# EAGLE schematic SensorBoard_copy (EAGLE 7.4.0)
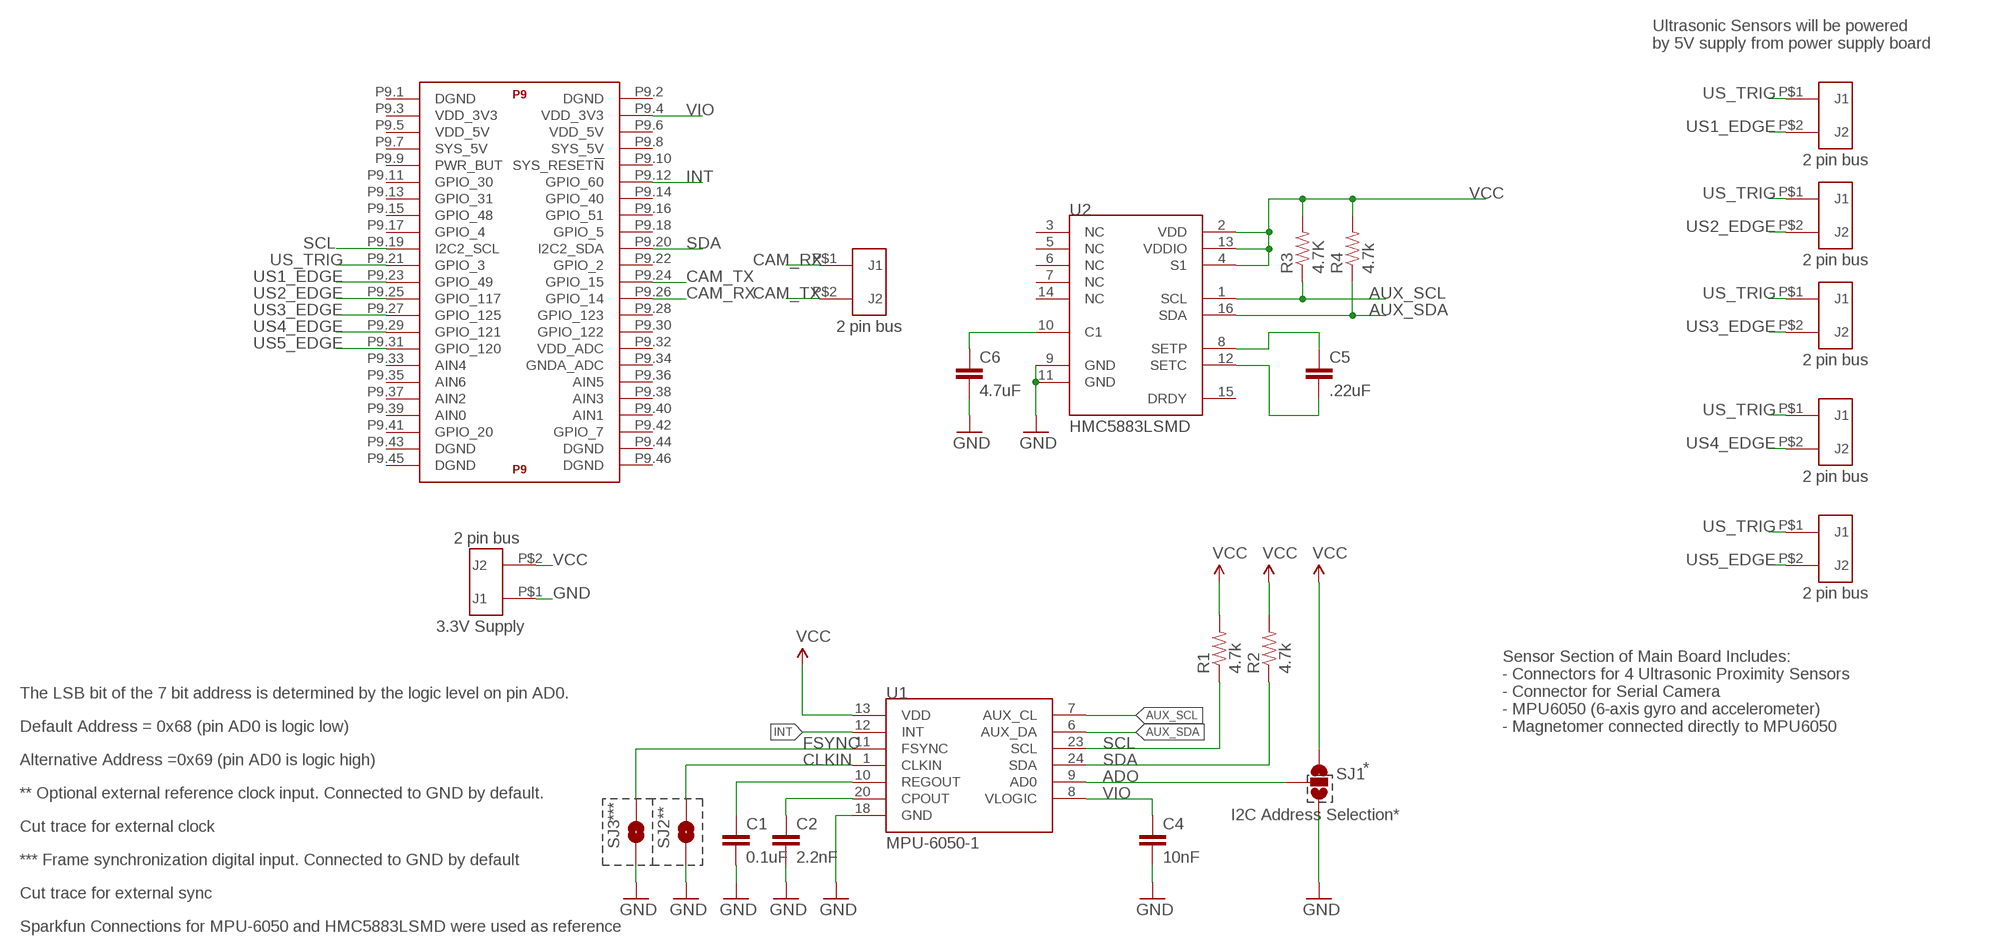
[diagram p0: schematic, sheet 1]

## Parts
C1  0.1uF  CAP0603-CAP  [0603-CAP]
C2  2.2nF  CAP0603-CAP  [0603-CAP]
C4  10nF  CAP0603-CAP  [0603-CAP]
C5  .22uF  CAP0402-CAP  [0402-CAP]
C6  4.7uF  CAP0402-CAP  [0402-CAP]
R1  4.7k  RESISTOR0603-RES  [0603-RES]
R2  4.7k  RESISTOR0603-RES  [0603-RES]
R3  4.7K  RESISTOR0402-RES  [0402-RES]
R4  4.7k  RESISTOR0402-RES  [0402-RES]
SJ1  SOLDERJUMPER_2WAYPASTE2&3  [SJ_3_PASTE2&3]
SJ2  SOLDERJUMPERTRACE  [SJ_2S-TRACE]
SJ3  SOLDERJUMPERTRACE  [SJ_2S-TRACE]
U1  MPU-6050-1  [QFN-24-4MM2]
U2  HMC5883LSMD  [16LPCC]
U$1  2PINBUS2HOLE  [2PINBUS]
U$2  BEAGLE_BONE_BLACK_CAPE  [BEAGLE_BONE_BLACK_CAPE]
U$3  2PINBUS2HOLE  [2PINBUS]
U$4  2PINBUS2HOLE  [2PINBUS]
U$6  2PINBUS2HOLE  [2PINBUS]
U$7  2PINBUS2HOLE  [2PINBUS]
U$8  2PINBUS2HOLE  [2PINBUS]
U$9  2PINBUS2HOLE  [2PINBUS]

## Nets
ADO: SJ1.2 U1.9(AD0)
AUX_SCL: R3.1 U1.7(AUX_CL) U2.1(SCL)
AUX_SDA: R4.1 U1.6(AUX_DA) U2.16(SDA)
CAM_RX: U$2.P9.26(P9:GPIO_14) U$3.P$1(J1)
CAM_TX: U$2.P9.24(P9:GPIO_15) U$3.P$2(J2)
CLKIN: SJ2.2 U1.1(CLKIN)
FSYNC: SJ3.2 U1.11(FSYNC)
GND: C1.2 C2.2 C4.2 C6.2 SJ1.3 SJ2.1 SJ3.1 U1.18(GND) U2.9(GND) U2.11(GND) U$9.P$1(J1)
INT: U1.12(INT) U$2.P9.12(P9:GPIO_60)
N$1: C5.2 U2.12(SETC)
N$2: C6.1 U2.10(C1)
N$3: C2.1 U1.20(CPOUT)
N$4: C5.1 U2.8(SETP)
N$5: C1.1 U1.10(REGOUT)
SCL: R1.1 U1.23(SCL) U$2.P9.19(P9:I2C2_SCL)
SDA: R2.1 U1.24(SDA) U$2.P9.20(P9:I2C2_SDA)
US1_EDGE: U$2.P9.23(P9:GPIO_49) U$8.P$2(J2)
US2_EDGE: U$2.P9.25(P9:GPIO_117) U$7.P$2(J2)
US3_EDGE: U$2.P9.27(P9:GPIO_125) U$6.P$2(J2)
US4_EDGE: U$2.P9.29(P9:GPIO_121) U$4.P$2(J2)
US5_EDGE: U$1.P$2(J2) U$2.P9.31(P9:GPIO_120)
US_TRIG: U$1.P$1(J1) U$2.P9.21(P9:GPIO_3) U$4.P$1(J1) U$6.P$1(J1) U$7.P$1(J1) U$8.P$1(J1)
VCC: R1.2 R2.2 R3.2 R4.2 SJ1.1 U1.13(VDD) U2.2(VDD) U2.4(S1) U2.13(VDDIO) U$9.P$2(J2)
VIO: C4.1 U1.8(VLOGIC) U$2.P9.4(P9:VDD_3V3)
Unconnected: U2.3(NC) U2.5(NC) U2.6(NC) U2.7(NC) U2.14(NC) U2.15(DRDY) U$2.P8.1(P8:DGND) U$2.P8.2(P8:DGND) U$2.P8.3(P8:GPIO_38) U$2.P8.4(P8:GPIO_39) U$2.P8.5(P8:GPIO_34) U$2.P8.6(P8:GPIO_35) U$2.P8.7(P8:GPIO_66) U$2.P8.8(P8:GPIO_67) U$2.P8.9(P8:GPIO_69) U$2.P8.10(P8:GPIO_68) U$2.P8.11(P8:GPIO_45) U$2.P8.12(P8:GPIO_44) U$2.P8.13(P8:GPIO_23) U$2.P8.14(P8:GPIO_26) U$2.P8.15(P8:GPIO_47) U$2.P8.16(P8:GPIO_46) U$2.P8.17(P8:GPIO_27) U$2.P8.18(P8:GPIO_65) U$2.P8.19(P8:GPIO_22) U$2.P8.20(P8:GPIO_63) U$2.P8.21(P8:GPIO_62) U$2.P8.22(P8:GPIO_37) U$2.P8.23(P8:GPIO_36) U$2.P8.24(P8:GPIO_33) U$2.P8.25(P8:GPIO_32) U$2.P8.26(P8:GPIO_61) U$2.P8.27(P8:GPIO_86) U$2.P8.28(P8:GPIO_88) U$2.P8.29(P8:GPIO_87) U$2.P8.30(P8:GPIO_89) U$2.P8.31(P8:GPIO_10) U$2.P8.32(P8:GPIO_11) U$2.P8.33(P8:GPIO_9) U$2.P8.34(P8:GPIO_81) U$2.P8.35(P8:GPIO_8) U$2.P8.36(P8:GPIO_80) U$2.P8.37(P8:GPIO_78) U$2.P8.38(P8:GPIO_79) U$2.P8.39(P8:GPIO_76) U$2.P8.40(P8:GPIO_77) U$2.P8.41(P8:GPIO_74) U$2.P8.42(P8:GPIO_75) U$2.P8.43(P8:GPIO_72) U$2.P8.44(P8:GPIO_73) U$2.P8.45(P8:GPIO_70) U$2.P8.46(P8:GPIO_71) U$2.P9.1(P9:DGND) U$2.P9.2(P9:DGND) U$2.P9.3(P9:VDD_3V3) U$2.P9.5(P9:VDD_5V) U$2.P9.6(P9:VDD_5V) U$2.P9.7(P9:SYS_5V) U$2.P9.8(P9:SYS_5V) U$2.P9.9(P9:PWR_BUT) U$2.P9.10(P9:SYS_RESET!N) U$2.P9.11(P9:GPIO_30) U$2.P9.13(P9:GPIO_31) U$2.P9.14(P9:GPIO_40) U$2.P9.15(P9:GPIO_48) U$2.P9.16(P9:GPIO_51) U$2.P9.17(P9:GPIO_4) U$2.P9.18(P9:GPIO_5) U$2.P9.22(P9:GPIO_2) U$2.P9.28(P9:GPIO_123) U$2.P9.30(P9:GPIO_122) U$2.P9.32(P9:VDD_ADC) U$2.P9.33(P9:AIN4) U$2.P9.34(P9:GNDA_ADC) U$2.P9.35(P9:AIN6) U$2.P9.36(P9:AIN5) U$2.P9.37(P9:AIN2) U$2.P9.38(P9:AIN3) U$2.P9.39(P9:AIN0) U$2.P9.40(P9:AIN1) U$2.P9.41(P9:GPIO_20) U$2.P9.42(P9:GPIO_7) U$2.P9.43(P9:DGND) U$2.P9.44(P9:DGND) U$2.P9.45(P9:DGND) U$2.P9.46(P9:DGND)

## Notes on the sheet
- Ultrasonic Sensors will be powered
  by 5V supply from power supply board
- 3.3V Supply
- The LSB bit of the 7 bit address is determined by the logic level on pin AD0.
- Default Address = 0x68 (pin AD0 is logic low)
- Sensor Section of Main Board Includes:
  - Connectors for 4 Ultrasonic Proximity Sensors
  - Connector for Serial Camera
  - MPU6050 (6-axis gyro and accelerometer)
  - Magnetomer connected directly to MPU6050
- Alternative Address =0x69 (pin AD0 is logic high) | *
- ** Optional external reference clock input. Connected to GND by default.
- *** | ** | I2C Address Selection*
- Cut trace for external clock
- *** Frame synchronization digital input. Connected to GND by default
- Cut trace for external sync
- Sparkfun Connections for MPU-6050 and HMC5883LSMD were used as reference

## Library data of the parts
C1 C2 C4-C6 = SparkFun:CAP: Capacitor Standard 0603 ceramic capacitor, and 0.1" leaded capacitor.
R1-R4 = SparkFun:RESISTOR: Resistor Basic schematic elements and footprints for 0603, 1206, and PTH resistors.
SJ1 = SparkFun:SOLDERJUMPER_2WAY: Solder Jumper 2 way solder jumper
SJ2 SJ3 = SparkFun:SOLDERJUMPER: Solder Jumper Standard SMD solder jumper. Used to automate production. Two varients : Normally Open and Normally Closed are the same, but have different paste layers. NC will have a large amount of paste and should jumper during reflow.
U1 = Testing:MPU-6050
U2 = SparkFun:HMC5883L: 3 Axis Digital Compass IC
U$1 U$3 U$4 U$6-U$9 = 2pin:2PINBUS
U$2 = SparkFun-Boards:BEAGLE_BONE_BLACK_CAPE

## Net classes
0 Default: width 0.203 mm